# Altium project Tray2.PrjPcb
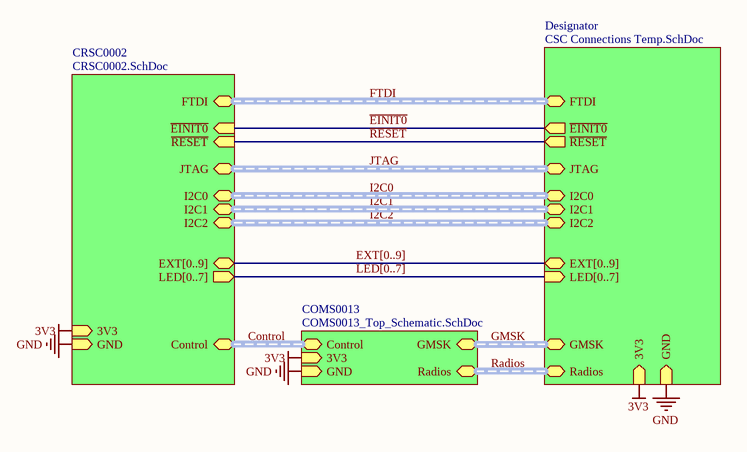
[diagram p0: Tray2.SchDoc]
2 sheets, 10 parts. Net scope: strictly hierarchical (ports join the sheet entries above them; power ports are local).
Board file: CSC 002B.PcbDoc
Sheets:
  Tray2.SchDoc
  COMS0004 SwC_Main.SchDoc

## Sheet Tray2.SchDoc
size A4

### Sub-sheets
COMS0013 = COMS0013_Top_Schematic.SchDoc (file not in this document): GMSK (harness GMSK), Radios (harness Radios), Control (harness CommsControl), 3V3 (in), GND (in)
CRSC0002 = CRSC0002.SchDoc (file not in this document): ~{EINIT0} (in), ~{RESET} (in), I2C1 (harness I2C), I2C0 (harness I2C), I2C2 (harness I2C), JTAG (harness JTAG), Control (harness CommsControl), FTDI (harness FTDI), EXT[0..9] (bidir), LED[0..7] (out), 3V3 (in), GND (in)
Designator = CSC Connections Temp.SchDoc (file not in this document): JTAG (harness JTAG), FTDI (harness FTDI), I2C0 (harness I2C), I2C1 (harness I2C), I2C2 (harness I2C), GMSK (harness GMSK), Radios (harness Radios), ~{RESET} (out), ~{EINIT0} (out), LED[0..7] (in), EXT[0..9] (bidir), 3V3 (in), GND (in)

### Nets
3V3: sheet CRSC0002/3V3, sheet COMS0013/3V3, sheet Designator/3V3
GND: sheet CRSC0002/GND, sheet COMS0013/GND, sheet Designator/GND
~{EINIT0}: sheet CRSC0002/~{EINIT0}, sheet Designator/~{EINIT0}
~{RESET}: sheet CRSC0002/~{RESET}, sheet Designator/~{RESET}

### Buses and harness runs
bus EXT[0..9] = sheet CRSC0002/EXT[0..9] = sheet Designator/EXT[0..9]
bus LED[0..7] = sheet CRSC0002/LED[0..7] = sheet Designator/LED[0..7]
harness Control = sheet COMS0013/Control = sheet CRSC0002/Control
harness FTDI = sheet CRSC0002/FTDI = sheet Designator/FTDI
harness GMSK = sheet COMS0013/GMSK = sheet Designator/GMSK
harness I2C0 = sheet CRSC0002/I2C0 = sheet Designator/I2C0
harness I2C1 = sheet CRSC0002/I2C1 = sheet Designator/I2C1
harness I2C2 = sheet CRSC0002/I2C2 = sheet Designator/I2C2
harness JTAG = sheet CRSC0002/JTAG = sheet Designator/JTAG
harness Radios = sheet COMS0013/Radios = sheet Designator/Radios

## Sheet COMS0004 SwC_Main.SchDoc: BLUEsat Switching Circuit Overview
size A3; Engineer: D. JEDRYCHOWSKI; Organization: BLUEsat Project; Address1: Room 419; Address2: School of EE&T; Address3: UNSW, NSW 2052; Address4: Australia; DocumentNumber: COMS0004; SheetNumber: 1; SheetTotal: 4; Description: Overview of Switching Circuit; Version: 1.0
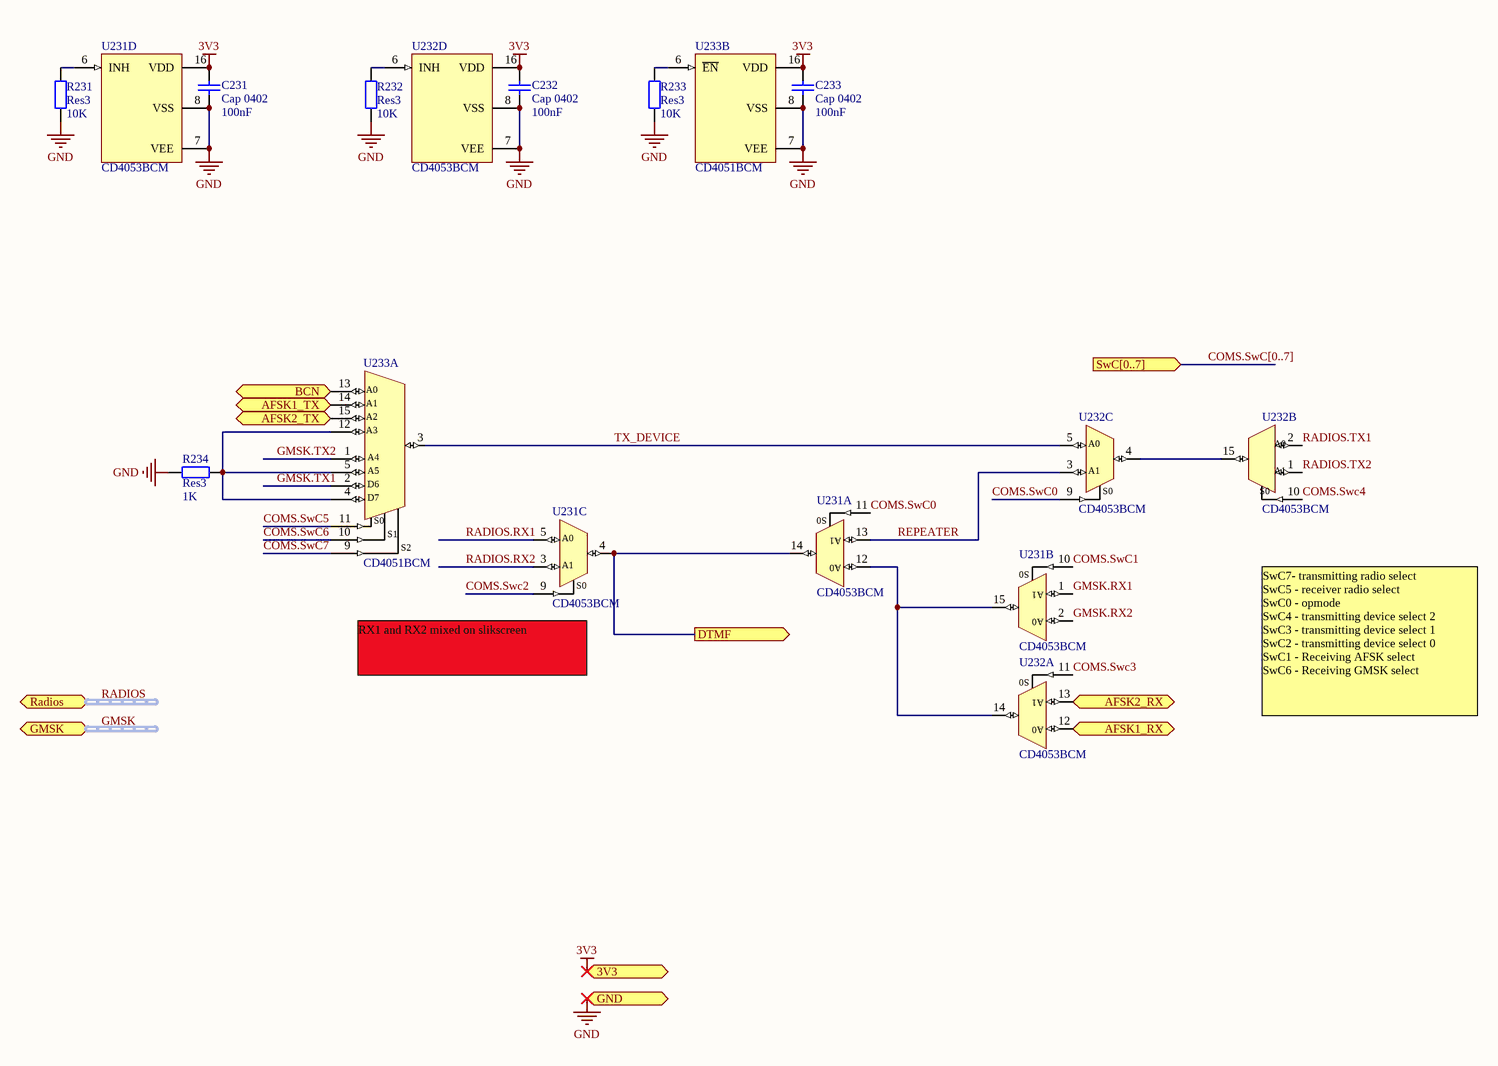
[diagram p1: COMS0004 SwC_Main.SchDoc]

### Parts
C231  Cap 0402  value 100nF  [CAPC1005X06L]
C232  Cap 0402  value 100nF  [CAPC1005X06L]
C233  Cap 0402  value 100nF  [CAPC1005X06L]
R231  Res3  value 10K  [RESC1005X06L]
R232  Res3  value 10K  [RESC1005X06L]
R233  Res3  value 10K  [RESC1005X06L]
R234  Res3  value 1K  [RESC1005X06L]
U231  CD4053BCM  [TSSOP16]  (parts A,B,C,D of 4)
U232  CD4053BCM  [TSSOP16]  (parts A,B,C,D of 4)
U233  CD4051BCM  [TSSOP16]  (parts A,B of 2)

### Ports
3V3 (in), AFSK1_RX (out), AFSK1_TX (in), AFSK2_RX (out), AFSK2_TX (in), BCN (in), DTMF (out), GMSK (harness GMSK), GND (in), Radios (harness RADIOS), SwC[0..7] (in)

### Nets
3V3: C231.2 C232.2 C233.2 U231.16(VDD) U232.16(VDD) U233.16(VDD) ; port 3V3
GND: C231.1 C232.1 C233.1 R231.2 R232.2 R233.2 R234.1 U231.7(VEE) U231.8(VSS) U232.7(VEE) U232.8(VSS) U233.7(VEE) U233.8(VSS) ; port GND
COMS.SwC0: U231.11(A) U232.9(C)
COMS.SwC1: U231.10(B)
COMS.Swc2: U231.9(C)
COMS.Swc3: U232.11(A)
COMS.Swc4: U232.10(B)
COMS.SwC5: U233.11(S0)
COMS.SwC6: U233.10(S1)
COMS.SwC7: U233.9(S2)
GMSK.RX1: U231.1(by)
GMSK.RX2: U231.2(bx)
GMSK.TX1: U233.2(A6)
GMSK.TX2: U233.1(A4)
RADIOS.RX1: U231.5(cx)
RADIOS.RX2: U231.3(cy)
RADIOS.TX1: U232.2(bx)
RADIOS.TX2: U232.1(by)
REPEATER: U231.13(A1) U232.3(cy)
TX_DEVICE: U232.5(cx) U233.3(O)
NetR231_1: R231.1 U231.6(INH)
NetR232_1: R232.1 U232.6(INH)
NetR233_1: R233.1 U233.6(~{EN})
NetR234_2: R234.2 U233.4(A7) U233.5(A5) U233.12(A3)
NetU231_4: U231.4(c_out) U231.14(A_out) ; port DTMF
NetU231_12: U231.12(A0) U231.15(b_out) U232.14(A_out)
NetU232_4: U232.4(c_out) U232.15(b_out)
NetU232_12: U232.12(A0) ; port AFSK1_RX
NetU232_13: U232.13(A1) ; port AFSK2_RX
NetU233_13: U233.13(A0) ; port BCN
NetU233_14: U233.14(A1) ; port AFSK1_TX
NetU233_15: U233.15(A2) ; port AFSK2_TX

### Buses and harness runs
bus COMS.SwC[0..7] = port SwC[0..7]
harness GMSK = port GMSK
harness RADIOS = port Radios

### Notes on the sheet
- (near U231) RX1 and RX2 mixed on slikscreen
- SwC7- transmitting radio select
  SwC5 - receiver radio select
  SwC0 - opmode
  SwC4 - transmitting device select 2
  SwC3 - transmitting device select 1
  SwC2 - transmitting device select 0
  SwC1 - Receiving AFSK select
  SwC6 - Receiving GMSK select
- Title
- Description:
- Size:
- Author:
- Date:
- A3
- Time:
- Version
- Sheet:
- Drawing No.:
- of
- File:
- (in symbol CD4051BCM, part A) D6; D7
- (in symbol CD4053BCM, part A) S0
- (in symbol CD4053BCM, part B) S0
- (in symbol CD4053BCM, part C) S0

### Library data of the parts
C231-C233 = Cap 0402: Capacitor; Published: 8-Jun-2000; LatestRevisionDate: 17-Jul-2002; LatestRevisionNote: Re-released for DXP Platform.; PackageReference: RAD-0.3; Publisher: Altium Limited; PackageDescription: Radial Cap, Thru-Hole; 2 Leads; 0.3 in Pin Spacing
R231-R234 = Res3: Resistor; Published: 8-Jun-2000; LatestRevisionDate: 29-May-2009; LatestRevisionNote: IPC-7351 Footprint Added.; PackageReference: J1-0603; Publisher: Altium Limited; PackageDescription: Chip Resistor
U231 U232 = CD4053BCM: Triple 2-Channnel Analog Multiplexer/Demutiplexer; Supplier 1: Farnell; Supplier Part Number 1: 2132284
U233 = CD4051BCM: 8-Channel Analog Multiplexer/Demultiplexer; Datasheet Link: http://focus.ti.com/lit/ds/symlink/cd4052b.pdf; Supplier 1: Farnell; Supplier Part Number 1: 1753421